# Altium schematic sheet PCB_PortIO1D.SchDoc
size A4; Organization: Altium Limited; Address1: L3, 12a Rodborough Rd; Address2: Frenchs Forest; Address3: NSW; Address4: Australia 2086; DocumentNumber: 7; SheetNumber: 7; SheetTotal: 7
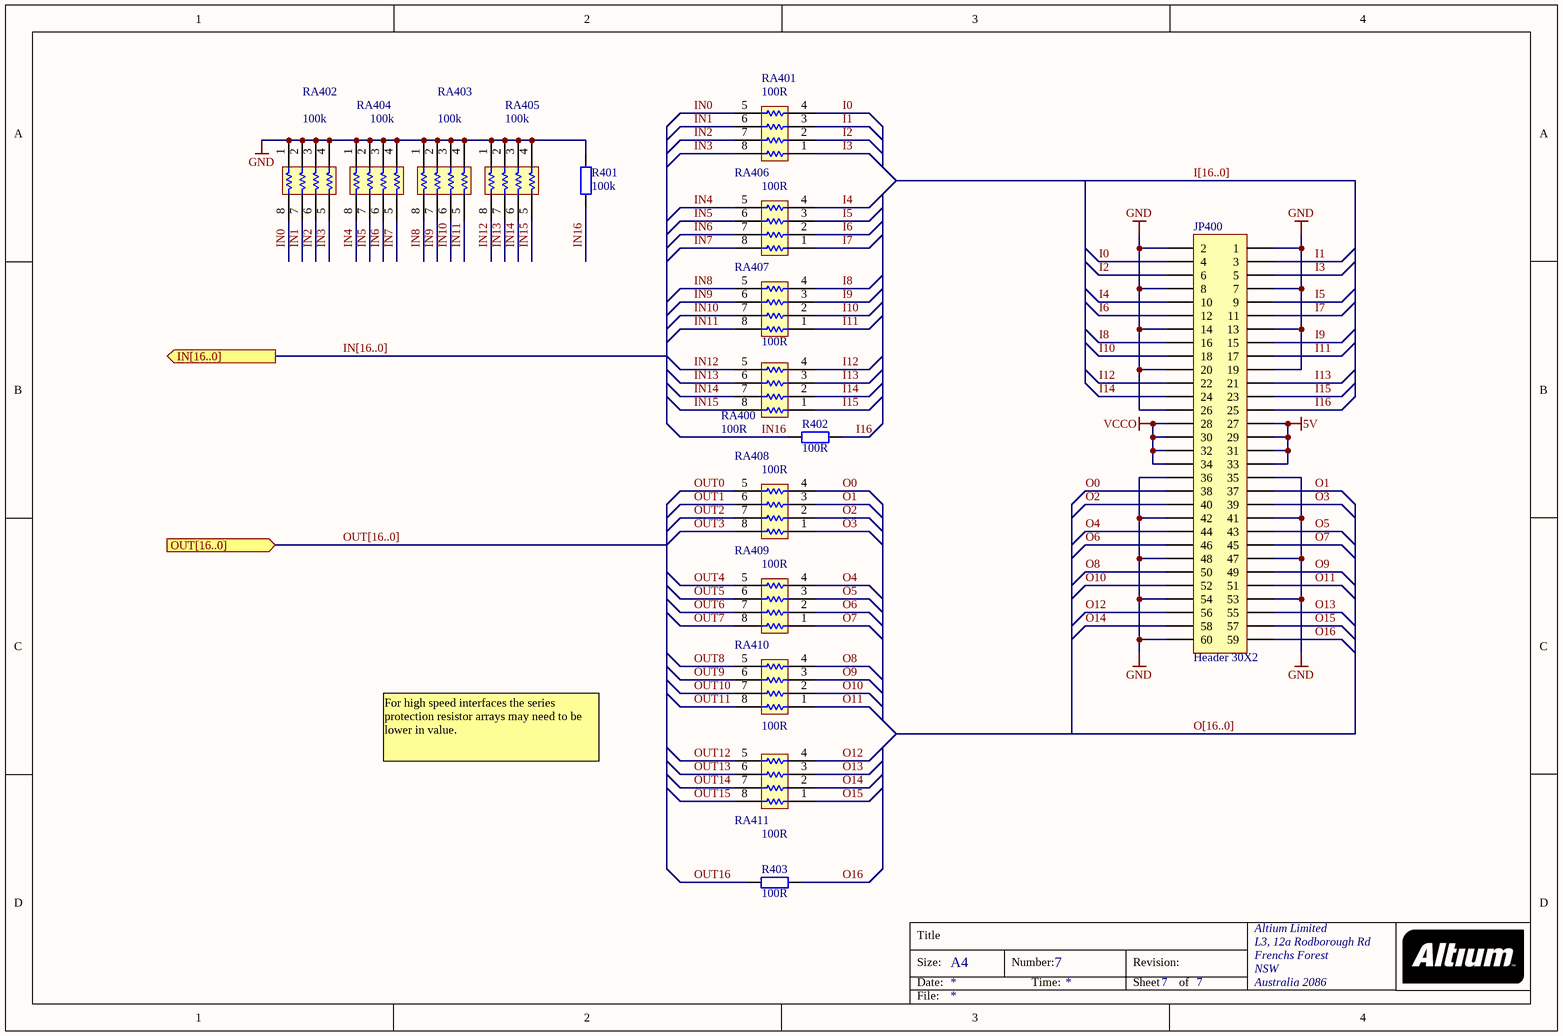
[diagram p0: PCB_PortIO1D.SchDoc]

## Parts
JP400  Header 30X2  [HDR2X30]
R401  100k  [CC2012-0805]
R402  100R  [CC2012-0805]
R403  100R  [CC2012-0805]
RA400  100R  [MNR34]
RA401  100R  [MNR34]
RA402  100k  [MNR34]
RA403  100k  [MNR34]
RA404  100k  [MNR34]
RA405  100k  [MNR34]
RA406  100R  [MNR34]
RA407  100R  [MNR34]
RA408  100R  [MNR34]
RA409  100R  [MNR34]
RA410  100R  [MNR34]
RA411  100R  [MNR34]

## Ports
IN[16..0] (out), OUT[16..0] (in)

## Nets
5V: JP400.27 JP400.29 JP400.31 JP400.33
GND: JP400.1 JP400.2 JP400.7 JP400.8 JP400.13 JP400.14 JP400.19 JP400.20 JP400.26 JP400.35 JP400.36 JP400.41 JP400.42 JP400.47 JP400.48 JP400.53 JP400.54 JP400.60 R401.1 RA402.1 RA402.2 RA402.3 RA402.4 RA403.1 RA403.2 RA403.3 RA403.4 RA404.1 RA404.2 RA404.3 RA404.4 RA405.1 RA405.2 RA405.3 RA405.4
VCCO: JP400.28 JP400.30 JP400.32 JP400.34
I0: JP400.4 RA401.4
I1: JP400.3 RA401.3
I2: JP400.6 RA401.2
I3: JP400.5 RA401.1
I4: JP400.10 RA406.4
I5: JP400.9 RA406.3
I6: JP400.12 RA406.2
I7: JP400.11 RA406.1
I8: JP400.16 RA407.4
I9: JP400.15 RA407.3
I10: JP400.18 RA407.2
I11: JP400.17 RA407.1
I12: JP400.22 RA400.4
I13: JP400.21 RA400.3
I14: JP400.24 RA400.2
I15: JP400.23 RA400.1
I16: JP400.25 R402.2
IN0: RA401.5 RA402.8
IN1: RA401.6 RA402.7
IN2: RA401.7 RA402.6
IN3: RA401.8 RA402.5
IN4: RA404.8 RA406.5
IN5: RA404.7 RA406.6
IN6: RA404.6 RA406.7
IN7: RA404.5 RA406.8
IN8: RA403.8 RA407.5
IN9: RA403.7 RA407.6
IN10: RA403.6 RA407.7
IN11: RA403.5 RA407.8
IN12: RA400.5 RA405.8
IN13: RA400.6 RA405.7
IN14: RA400.7 RA405.6
IN15: RA400.8 RA405.5
IN16: R401.2 R402.1
O0: JP400.38 RA408.4
O1: JP400.37 RA408.3
O2: JP400.40 RA408.2
O3: JP400.39 RA408.1
O4: JP400.44 RA409.4
O5: JP400.43 RA409.3
O6: JP400.46 RA409.2
O7: JP400.45 RA409.1
O8: JP400.50 RA410.4
O9: JP400.49 RA410.3
O10: JP400.52 RA410.2
O11: JP400.51 RA410.1
O12: JP400.56 RA411.4
O13: JP400.55 RA411.3
O14: JP400.58 RA411.2
O15: JP400.57 RA411.1
O16: JP400.59 R403.2
OUT0: RA408.5
OUT1: RA408.6
OUT2: RA408.7
OUT3: RA408.8
OUT4: RA409.5
OUT5: RA409.6
OUT6: RA409.7
OUT7: RA409.8
OUT8: RA410.5
OUT9: RA410.6
OUT10: RA410.7
OUT11: RA410.8
OUT12: RA411.5
OUT13: RA411.6
OUT14: RA411.7
OUT15: RA411.8
OUT16: R403.1

## Buses and harness runs
bus I[16..0]
bus IN[16..0] = port IN[16..0]
bus O[16..0]
bus OUT[16..0] = port OUT[16..0]

## Notes on the sheet
- For high speed interfaces the series protection resistor arrays may need to be lower in value.
- Title
- Size:
- Date:
- A4
- Number:
- Time:
- Revision:
- Sheet
- of
- File:

## Library data of the parts
JP400 = Header 30X2: Header, 30-Pin, Dual row; Manufacturer: Generic Components; Class I: Connector; Revision: July-2002: Re-released for DXP Platform.; Publisher: Altium Limited
R401-R403 = Res2: Resistor; Manufacturer: Generic Components; Class I: Passive; Published: 8-Jun-2000; Revision: July-2002: Re-released for DXP Platform.; Publisher: Altium Limited; Class II: Resistor
RA400-RA411 = MNR34: 3216x4 Resistor Array; Fitted: True